# EAGLE design Pi-Matic.-.v0.1 (EAGLE 6.5.0)
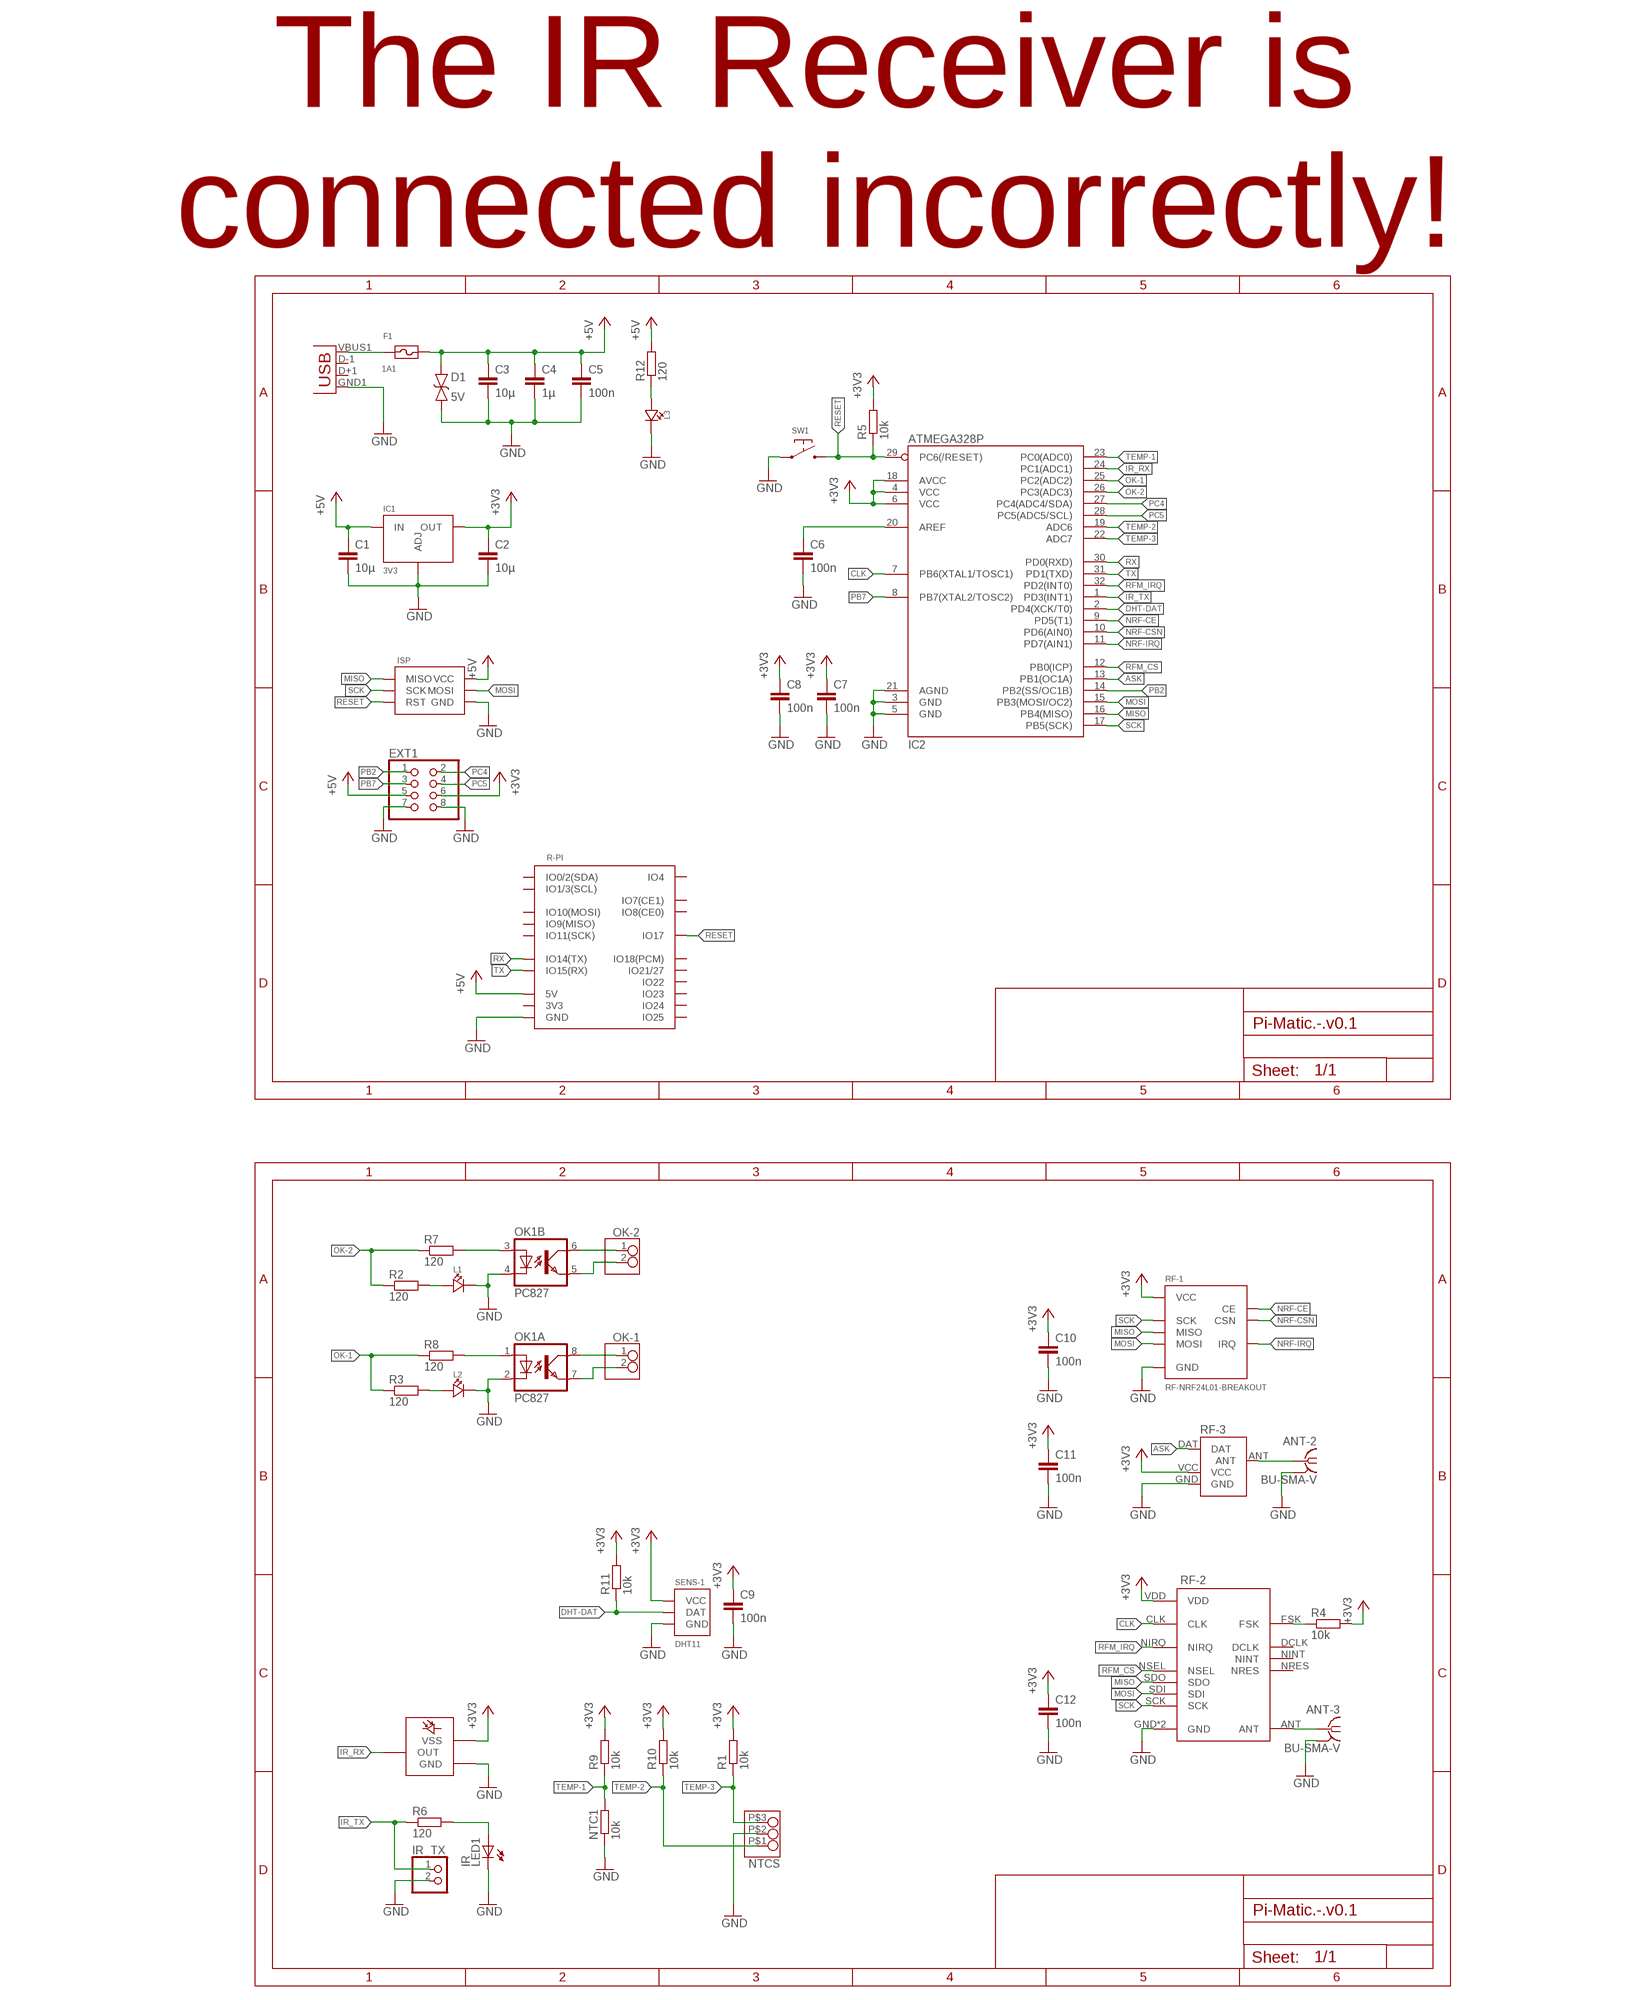
[diagram p0: schematic, sheet 1]

## Parts
ANT-2  BU-SMA-V  [BU-SMA-V]
ANT-3  BU-SMA-V  [BU-SMA-V]
C1  10µ  C-EUC0805  [C0805]
C2  10µ  C-EUC0805  [C0805]
C3  10µ  C-EUC0805  [C0805]
C4  1µ  C-EUC0805  [C0805]
C5  100n  C-EUC0603  [C0603]
C6  100n  C-EUC0603  [C0603]
C7  100n  C-EUC0603  [C0603]
C8  100n  C-EUC0603  [C0603]
C9  100n  C-EUC0603  [C0603]
C10  100n  C-EUC0603  [C0603]
C11  100n  C-EUC0603  [C0603]
C12  100n  C-EUC0603  [C0603]
D1  5V  DIODE-TVS-BI  [R0603]
EXT1  PINHD-2X4  [2X04]
F1  1A1  FUSE1812  [SMD-1812]
IC1  3V3  REGULATOR-TLV1117SOT223  [SOT223]
IC2  ATMEGA328P  ATMEGA328_SMT  [TQFP32-08]
IR_TX  PINHD-1X2/90  [1X02/90]
ISP  ISP-6_PIN-NORMAL  [PINHEADER-100-MIL-2X6-ISP]
L1  LED0603  [CHIPLED_0603]
L2  LED0603  [CHIPLED_0603]
L3  LED0603  [CHIPLED_0603]
LED1  IR  LED5MM  [LED5MM]
NTC1  10k  R-EU_R0805  [R0805]
NTCS  GENERIC-1X3WAGO-5MM  [WAGO-5MM-3_PIN]
OK1  PC827  OPTOCOUPLER-PC827SMD  [SMD08]
OK-1  GENERIC-1X2_PINWAGO-5MM-N  [WAGO-5MM-2_PIN-1]
OK-2  GENERIC-1X2_PINWAGO-5MM-N  [WAGO-5MM-2_PIN-1]
R1  10k  R-EU_R0603  [R0603]
R2  120  R-EU_R0603  [R0603]
R3  120  R-EU_R0603  [R0603]
R4  10k  R-EU_R0603  [R0603]
R5  10k  R-EU_R0603  [R0603]
R6  120  R-EU_R0603  [R0603]
R7  120  R-EU_R0603  [R0603]
R8  120  R-EU_R0603  [R0603]
R9  10k  R-EU_R0603  [R0603]
R10  10k  R-EU_R0603  [R0603]
R11  10k  R-EU_R0603  [R0603]
R12  120  R-EU_R0603  [R0603]
R-PI  RASPBERRY-PI  [RASPBERRY-PI]
RF-1  RF-NRF24L01-BREAKOUT  [RF-NRF2401]
RF-2  RADIO-RFM12SMD  [RADIO-RFM12-SMD]
RF-3  RADIO-QAM_TX1  [RADIO-ASK-QAM-TX1-SIP]
SENS-1  DHT11  DHT11DHT11  [SENSOR-DHT11]
SW1  SWITCH-DEFAULT_OFF-SMD-2_PIN  [SWITCH-SMD-2_PIN-DX]
U$1  IR-RECIEVERTSOP348XX  [IR-REC-3PIN]
U$3  USB  [USB-AB-MICRO-SMD_V03]

## Nets
+3V3: C2.1 C7.1 C8.1 C9.1 C10.1 C11.1 C12.1 EXT1.6 IC1.2(OUT) IC1.4(OUT) IC2.4(VCC) IC2.6(VCC) IC2.18(AVCC) R1.2 R4.2 R5.2 R9.2 R10.2 R11.2 RF-1.P$2(VCC) RF-2.VDD RF-3.VCC SENS-1.P$1(VCC) U$1.P$3(VSS)
+5V: C1.1 C3.1 C4.1 C5.1 D1.1 EXT1.5 F1.P$2 IC1.3(IN) ISP.P$6(VCC) R12.2 R-PI.2(5V) R-PI.4(5V)
ASK: IC2.13(PB1(OC1A)) RF-3.DAT
CLK: IC2.7(PB6(XTAL1/TOSC1)) RF-2.CLK
DHT-DAT: IC2.2(PD4(XCK/T0)) R11.1 SENS-1.P$2(DAT)
GND: ANT-2.2 ANT-2.3 ANT-2.4 ANT-2.5 ANT-3.2 ANT-3.3 ANT-3.4 ANT-3.5 C1.2 C2.2 C3.2 C4.2 C5.2 C6.2 C7.2 C8.2 C9.2 C10.2 C11.2 C12.2 D1.2 EXT1.7 EXT1.8 IC1.1(ADJ) IC2.3(GND) IC2.5(GND) IC2.21(AGND) IR_TX.2 ISP.P$4(GND) L1.C L2.C L3.C LED1.K(C) NTC1.1 NTCS.P$2 OK1.2(A:C) OK1.4(B:C) R-PI.6(GND) R-PI.9(GND) R-PI.14(GND) R-PI.20(GND) R-PI.25(GND) RF-1.P$1(GND) RF-2.GND RF-2.GND_(GND) RF-3.GND SENS-1.P$4(GND) SW1.P$1 U$1.P$2(GND) U$3.GND1(GND)
IR_RX: IC2.24(PC1(ADC1)) U$1.P$1(OUT)
IR_TX: IC2.1(PD3(INT1)) IR_TX.1 R6.1
MISO: IC2.16(PB4(MISO)) ISP.P$1(MISO) RF-1.P$7(MISO) RF-2.SDO
MOSI: IC2.15(PB3(MOSI/OC2)) ISP.P$5(MOSI) RF-1.P$6(MOSI) RF-2.SDI
N$1: ANT-2.1 RF-3.ANT
N$2: ANT-3.1 RF-2.ANT
N$3: LED1.A R6.2
N$4: R4.1 RF-2.FSK
N$5: OK1.1(A:A) R8.2
N$6: OK1.3(B:A) R7.2
N$7: OK1.5(B:EMIT) OK-2.2
N$8: OK1.6(B:COL) OK-2.1
N$9: OK1.8(A:COL) OK-1.1
N$10: OK1.7(A:EMIT) OK-1.2
N$11: L1.A R2.2
N$12: L2.A R3.2
N$13: F1.P$1 U$3.VBUS1(VBUS)
N$14: L3.A R12.1
N$15: C6.1 IC2.20(AREF)
NRF-CE: IC2.9(PD5(T1)) RF-1.P$3(CE)
NRF-CSN: IC2.10(PD6(AIN0)) RF-1.P$4(CSN)
NRF-IRQ: IC2.11(PD7(AIN1)) RF-1.P$8(IRQ)
OK-1: IC2.25(PC2(ADC2)) R3.1 R8.1
OK-2: IC2.26(PC3(ADC3)) R2.1 R7.1
PB2: EXT1.1 IC2.14(PB2(SS/OC1B))
PB7: EXT1.3 IC2.8(PB7(XTAL2/TOSC2))
PC4: EXT1.2 IC2.27(PC4(ADC4/SDA))
PC5: EXT1.4 IC2.28(PC5(ADC5/SCL))
RESET: IC2.29(PC6(/RESET)) ISP.P$3(RST) R5.1 R-PI.11(IO17) SW1.P$2
RFM_CS: IC2.12(PB0(ICP)) RF-2.NSEL
RFM_IRQ: IC2.32(PD2(INT0)) RF-2.NIRQ
RX: IC2.30(PD0(RXD)) R-PI.8(IO14(TX))
SCK: IC2.17(PB5(SCK)) ISP.P$2(SCK) RF-1.P$5(SCK) RF-2.SCK
TEMP-1: IC2.23(PC0(ADC0)) NTC1.2 R9.1
TEMP-2: IC2.19(ADC6) NTCS.P$1 R10.1
TEMP-3: IC2.22(ADC7) NTCS.P$3 R1.1
TX: IC2.31(PD1(TXD)) R-PI.10(IO15(RX))
Unconnected: R-PI.1(3V3) R-PI.3(IO0/2(SDA)) R-PI.5(IO1/3(SCL)) R-PI.7(IO4) R-PI.12(IO18(PCM)) R-PI.13(IO21/27) R-PI.15(IO22) R-PI.16(IO23) R-PI.17(3V3) R-PI.18(IO24) R-PI.19(IO10(MOSI)) R-PI.21(IO9(MISO)) R-PI.22(IO25) R-PI.23(IO11(SCK)) R-PI.24(IO8(CE0)) R-PI.26(IO7(CE1)) RF-2.DCLK RF-2.NINT RF-2.NRES U$3.D+1(D+) U$3.D-1(D-)

## Notes on the sheet
- The IR Receiver is
  connected incorrectly!

## Library data of the parts
ANT-2 ANT-3 = con-coax:BU-SMA-V: FEMALE SMA CONNECTOR Radiall distributor RS 112-3794; OC_FARNELL: unknown; OC_NEWARK: unknown
C1-C12 = p.peter-rcl:C-EU: CAPACITOR, European symbol
D1 = p.peter-passives:DIODE-TVS-BI
EXT1 = pinhead:PINHD-2X4: PIN HEADER
F1 = p.peter-regulators:FUSE
IC1 = p.peter-regulators:REGULATOR-TLV1117
IC2 = SparkFun-DigitalIC:ATMEGA328_SMT: 32-Pin Atmega328 part Commonly used on Arduino compatible boards Available in QFP and QFN packages TQFP is IC-09069 QFN is non-stock; PROD_ID: IC-09069
IR_TX = pinhead:PINHD-1X2: PIN HEADER
ISP = p.peter-connectors:ISP-6_PIN: AVR 6 PIN ISP header Edge connector normal layout
L1-L3 = p.peter-leds:LED
LED1 = led:LED: LED OSRAM: - CHIPLED LG R971, LG N971, LY N971, LG Q971, LY Q971, LO R971, LY R971 LH N974, LH R974 LS Q976, LO Q976, LY Q976 LO Q996 - Hyper CHIPLED LW Q18S LB Q993, LB Q99A, LB R99A - SideLED LS A670, LO A670, LY A670, LG A670, LP A670 LB A673, LV A673, LT A673, LW A673 LH A674 LY A675 LS A676, LA A676, LO A676, LY A676, LW A676 LS A679, LY A679, LG A679 - Hyper Micro SIDELED® LS Y876, LA Y876, LO Y876, LY Y876 LT Y87S - SmartLED LW L88C, LW L88S LB L89C, LB L89S, LG L890 LS L89K, LO L89K, LY L89K LS L896, LA L896, LO L896, LY L896 - TOPLED LS T670, LO T670, LY T670, LG T670, LP T670 LSG T670, LSP T670, LSY T670, LOP T670, LYG T670 LG T671, LOG T671, LSG T671 LB T673, LV T673, LT T673, LW T673 LH T674 LS T676, LA T676, LO T676, LY T676, LB T676, LH T676, LSB T676, LW T676 LB T67C, LV T67C, LT T67C, LS T67K, LO T67K, LY T67K, LW E67C LS E67B, LA E67B, LO E67B, LY E67B, LB E67C, LV E67C, LT E67C LW T67C LS T679, LY T679, LG T679 LS T770, LO T770, LY T770, LG T770, LP T770 LB T773, LV T773, LT T773, LW T773 LH T774 LS E675, LA E675, LY E675, LS T675 LS T776, LA T776, LO T776, LY T776, LB T776 LHGB T686 LT T68C, LB T68C - Hyper Mini TOPLED® LB M676 - Mini TOPLED Santana® LG M470 LS M47K, LO M47K, LY M47K Source: http://www.osram.convergy.de LUXEON: - LUMILED® LXK2-PW12-R00, LXK2-PW12-S00, LXK2-PW14-U00, LXK2-PW14-V00 LXK2-PM12-R00, LXK2-PM12-S00, LXK2-PM14-U00 LXK2-PE12-Q00, LXK2-PE12-R00, LXK2-PE12-S00, LXK2-PE14-T00, LXK2-PE14-U00 LXK2-PB12-K00, LXK2-PB12-L00, LXK2-PB12-M00, LXK2-PB14-N00, LXK2-PB14-P00, LXK2-PB14-Q00 LXK2-PR12-L00, LXK2-PR12-M00, LXK2-PR14-Q00, LXK2-PR14-R00 LXK2-PD12-Q00, LXK2-PD12-R00, LXK2-PD12-S00 LXK2-PH12-R00, LXK2-PH12-S00 LXK2-PL12-P00, LXK2-PL12-Q00, LXK2-PL12-R00 Source: www.luxeon.com KINGBRIGHT: KA-3528ASYC Source: www.kingbright.com
NTC1 R1-R12 = p.peter-rcl:R-EU_: RESISTOR, European symbol
NTCS = p.peter-connectors:GENERIC-1X3
OK1 = p.peter-ics:OPTOCOUPLER-PC827: SHARP OPTO COUPLER
OK-1 OK-2 = p.peter-connectors:GENERIC-1X2_PIN
R-PI = p.peter-periphery:RASPBERRY-PI: Raspberry Pi Board <http://www.raspberrypi.org/> Jacques Lagnel V1.0 (beta) 2012 Board dimension: Forum 3D model <http://www.raspberrypi.org/forum/general-discussion/mechanical-profile-3d-models?value=3d%20model&type=1&include=1&search=1&ret=all> The GPIO Connector (P1): http://elinux.org/RPi_Low-level_peripherals
RF-1 = p.peter-periphery:RF-NRF24L01
RF-2 = p.peter-ics:RADIO-RFM12: RFM12 Funk Modul
RF-3 = p.peter-ics:RADIO-QAM_TX1
SENS-1 = p.peter-periphery:DHT11
SW1 = p.peter-passives:SWITCH-DEFAULT_OFF
U$1 = p.peter-leds:IR-RECIEVER
U$3 = p.peter-connectors:USB

## Board
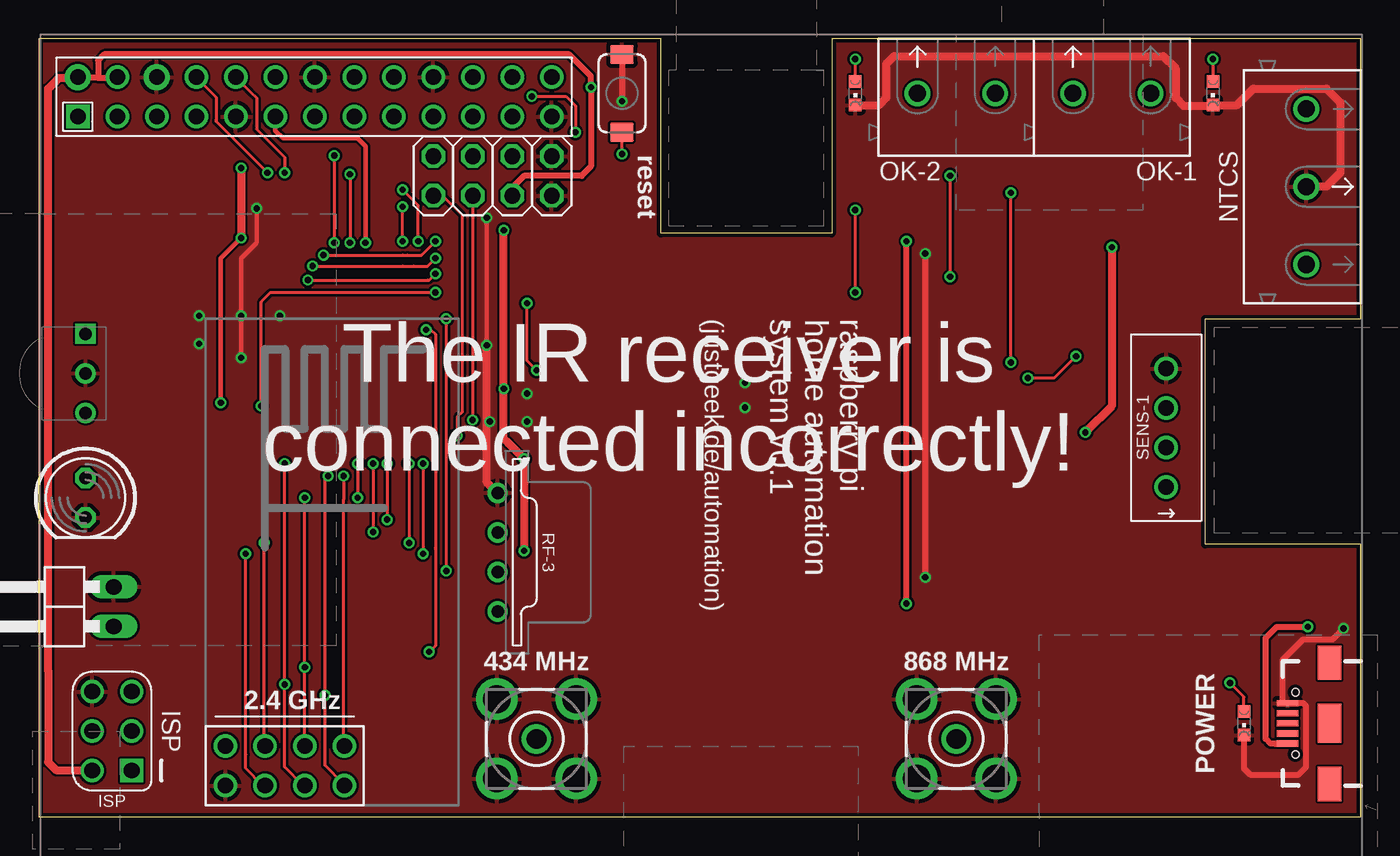
[diagram p1: board, top side]
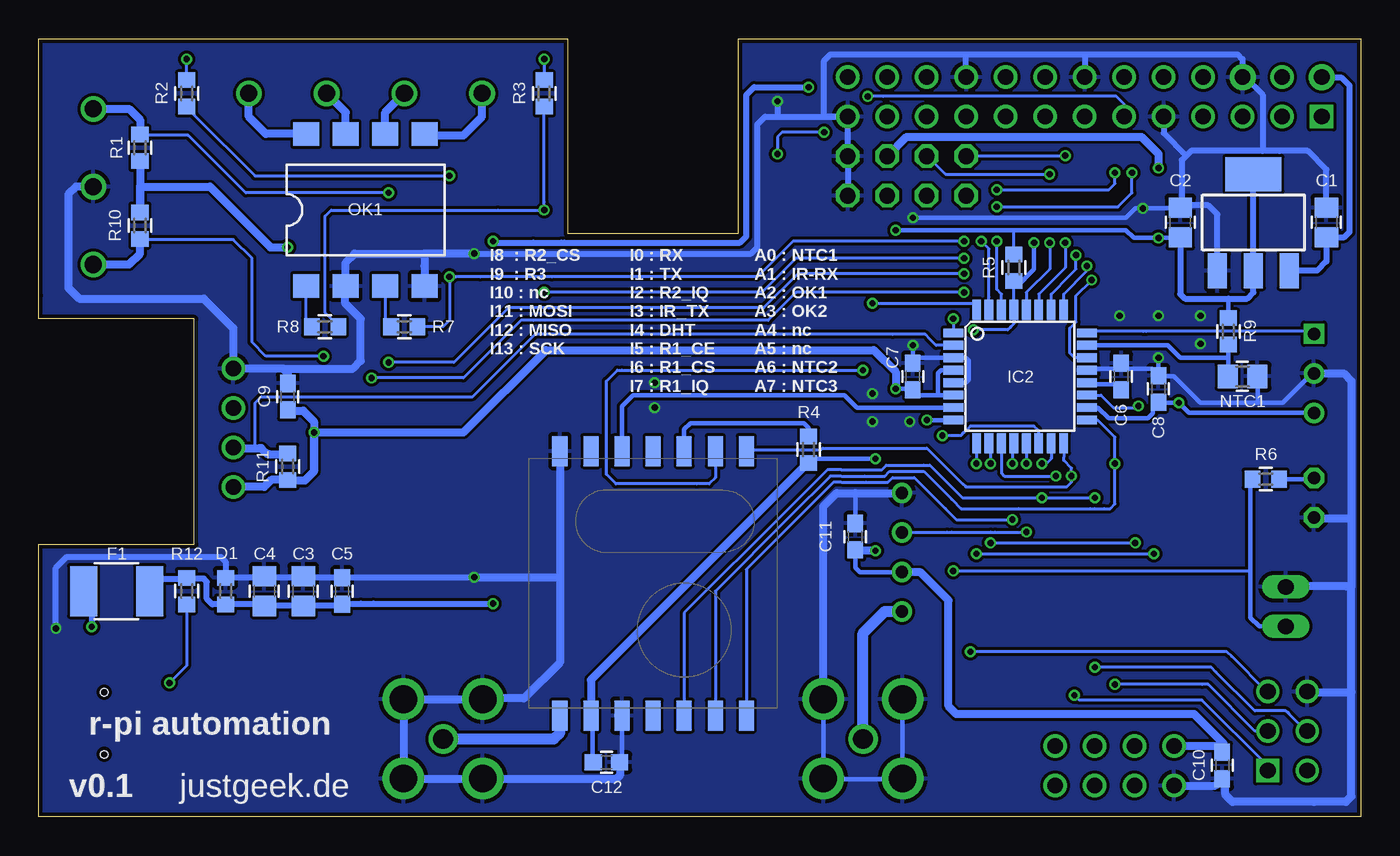
[diagram p2: board, bottom side, seen from below]

Size 85 x 50 mm. Coordinates in mm from the lower left corner, seen from the top.
Outline: 0,0 85,0 85,17.5 75,17.5 75,32 85,32 85,33.5 85,50 51,50 51,37.5 40,37.5 40,50 0,50 0,0
Copper layers (1*16): Top 0.035mm / dielectric 1.5mm / Bottom 0.035mm
Design rules "Elecrow_2-layer_eagle_rule *": minimum track width 6mil, minimum drill 12mil, track to track 6mil, track to pad 6mil, pad to pad 6mil, via to via 6mil, smd to smd 0mil, copper to edge 10mil, drill to drill 10mil, minimum pad ring 10mil, minimum via ring 6mil, stop-mask expansion 2mil, vias tented up to drill 100mil, thermal gap 10mil

### Footprints (pad centres in the part's own frame; a part is rotated, then mirrored left to right if it is on the bottom)
BU-SMA-V = drill 1.27: 1 0,0 | drill 1.778: 2 -2.55,2.55; 3 2.55,2.55; 4 2.55,-2.55; 5 -2.55,-2.55
C0805 = smd 1.3 x 1.5: 1 -0.95,0; 2 0.95,0
C0603 = smd 1.1 x 1: 1 -0.85,0; 2 0.85,0
R0603 = smd 1 x 1.1: 1 -0.85,0; 2 0.85,0
2X04 = drill 1.016 octagon: 1 -3.81,-1.27; 2 -3.81,1.27; 3 -1.27,-1.27; 4 -1.27,1.27; 5 1.27,-1.27; 6 1.27,1.27; 7 3.81,-1.27; 8 3.81,1.27
SMD-1812 = smd 1.75 x 3.2: P$1 -2.125,0; P$2 2.125,0
SOT223 = smd 1.219 x 2.235: 1 -2.311,-3.099; 2 0,-3.099; 3 2.311,-3.099 | smd 3.6 x 2.2: 4 0,3.099
TQFP32-08 = smd 1.27 x 0.559: 1 -4.293,2.8; 2 -4.293,2; 3 -4.293,1.2; 4 -4.293,0.4; 5 -4.293,-0.4; 6 -4.293,-1.2; 7 -4.293,-2; 8 -4.293,-2.8; 17 4.293,-2.8; 18 4.293,-2; 19 4.293,-1.2; 20 4.293,-0.4; 21 4.293,0.4; 22 4.293,1.2; 23 4.293,2; 24 4.293,2.8 | smd 0.559 x 1.27: 9 -2.8,-4.293; 10 -2,-4.293; 11 -1.2,-4.293; 12 -0.4,-4.293; 13 0.4,-4.293; 14 1.2,-4.293; 15 2,-4.293; 16 2.8,-4.293; 25 2.8,4.293; 26 2,4.293; 27 1.2,4.293; 28 0.4,4.293; 29 -0.4,4.293; 30 -1.2,4.293; 31 -2,4.293; 32 -2.8,4.293
1X02/90 = drill 1.016 long: 1 -1.27,-3.81; 2 1.27,-3.81
PINHEADER-100-MIL-2X6-ISP = drill 1 square: P$1 -2.54,-1.27 | drill 1: P$2 0,-1.27; P$3 2.54,-1.27; P$4 2.54,1.27; P$5 0,1.27; P$6 -2.54,1.27
CHIPLED_0603 = smd 0.8 x 0.8: A 0,-0.75; C 0,0.75
LED5MM = drill 0.813 octagon: A -1.27,0; K 1.27,0
R0805 = smd 1.3 x 1.5: 1 -0.95,0; 2 0.95,0
WAGO-5MM-3_PIN = drill 1.1: P$1 -5,0; P$2 0,0; P$3 5,0
SMD08 = smd 1.651 x 1.524: 1 -3.81,-4.889; 2 -1.27,-4.889; 3 1.27,-4.889; 4 3.81,-4.889; 5 3.81,4.889; 6 1.27,4.889; 7 -1.27,4.889; 8 -3.81,4.889
WAGO-5MM-2_PIN-1 = drill 1.1: 1 -2.5,0; 2 2.5,0
RASPBERRY-PI = drill 1 square: 1 0,0 | drill 1 pad 1.676: 2 0,2.54; 6 5.08,2.54 | drill 1: 3 2.54,0; 4 2.54,2.54; 5 5.08,0; 7 7.62,0; 8 7.62,2.54; 9 10.16,0; 10 10.16,2.54; 11 12.7,0; 12 12.7,2.54; 13 15.24,0; 14 15.24,2.54; 15 17.78,0; 16 17.78,2.54; 17 20.32,0; 18 20.32,2.54; 19 22.86,0; 20 22.86,2.54; 21 25.4,0; 22 25.4,2.54; 23 27.94,0; 24 27.94,2.54; 25 30.48,0; 26 30.48,2.54
RF-NRF2401 = drill 1: P$1 0,0; P$2 0,2.55; P$3 2.55,0; P$4 2.55,2.55; P$5 5.1,0; P$6 5.1,2.55; P$7 7.65,0; P$8 7.65,2.55
RADIO-RFM12-SMD = smd 1.93 x 0.965: ANT 8.5,-6; CLK -8.5,-2; DCLK -8.5,0; FSK -8.5,2; GND -8.5,-6; GND_ 8.5,-2; NINT 8.5,0; NIRQ -8.5,4; NRES -8.5,-4; NSEL 8.5,6; SCK 8.5,4; SDI 8.5,2; SDO -8.5,6; VDD 8.5,-4
RADIO-ASK-QAM-TX1-SIP = drill 0.8: ANT 3.81,0; DAT -1.27,0; GND -3.81,0; VCC 1.27,0
SENSOR-DHT11 = drill 1: P$1 -3.81,0; P$2 -1.27,0; P$3 1.27,0; P$4 3.81,0
SWITCH-SMD-2_PIN-DX = smd 1.2 x 1.5: P$1 -2.5,0; P$2 2.5,0
IR-REC-3PIN = drill 0.8 square: P$1 -2.54,0 | drill 0.8: P$2 0,0; P$3 2.54,0
USB-AB-MICRO-SMD_V03 = smd 1.4 x 0.4: D+1 2.7,0; D-1 2.7,0.65; GND1 2.7,-1.3; ID1 2.7,-0.65; VBUS1 2.7,1.3 | smd 1.5 x 2.2: P$1 0,3.9; P$2 0,-3.9 | smd 1.5 x 2.5: P$3 0,0 | hole 0.45: 2.2,2; 2.2,-2

### Placement (x,y rotation side)
ANT-2  32,5 0 top
ANT-3  59,5 0 top
C1  2.2,38.2 90 bottom
C2  11.6,38.2 90 bottom
C3  68,14.5 90 bottom
C4  70.5,14.5 90 bottom
C5  65.5,14.5 90 bottom
C6  15.4,28.3 90 bottom
C7  28.8,28.3 90 bottom
C8  13,27.5 90 bottom
C9  69,27 90 bottom
C10  8.9,3.3 270 bottom
C11  32.5,18 90 bottom
C12  48.5,3.5 0 bottom
D1  73,14.5 90 bottom
EXT1  29.18,41.2 0 top
F1  80,14.5 0 bottom
IC1  6.9,38.2 0 bottom
IC2  21.9,28.3 0 bottom
IR_TX  1,13.5 90 top
ISP  4.7,5.5 90 top
L1  75.5,46.5 180 top
L2  52.5,46.5 180 top
L3  77.5,6 180 top
LED1  3,20.5 270 top
NTC1  7.6,28.3 180 bottom
NTCS  81.5,40.5 90 top
OK1  64,39 0 bottom
OK-1  69,46.5 180 top
OK-2  59,46.5 180 top
R1  78.5,43 270 bottom
R2  75.5,46.5 90 bottom
R3  52.5,46.5 90 bottom
R4  35.5,23.6 270 bottom
R5  22.3,35.3 90 bottom
R6  6.1,21.7 0 bottom
R7  61.5,31.5 180 bottom
R8  66.6,31.5 180 bottom
R9  8.5,31.2 90 bottom
R10  78.5,38 90 bottom
R11  69,22.5 270 bottom
R12  75.5,14.5 90 bottom
R-PI  2.5,45 0 top
RF-1  12,2 0 top
RF-2  45.5,15 270 bottom
RF-3  29.5,17 270 top
SENS-1  72.5,25 90 top
SW1  37.5,46.5 270 top
U$1  3,28.5 270 top
U$2  [LOGO-JUSTGEEK-XS-MASK]  50,9.5 270 top
U$3  83,6 180 top

### Tracks (layer width: path | path; a pad name or v marks a point on that pad's centre or on a via)
+3V3  (via drill 0.4)
  Top 0.3: v11.7,26.6 11.7,35.9 v13,37.2
  Top 0.5: v29.9,37.7 v29.9,27.5 29.9,24.3 30.2,24 v31.2,23 v31.2,17.1 | v13,41.7 13,37.3 v13,37.2 | v69,36.6 69,26.4 v67.3,24.7
  Bottom 0.2: R5.2 22.3,36.1 22.3,37.7
  Bottom 0.3: C11.1 32.5,16 32.2,15.7 29.53,15.7 RF-3.VCC | C12.1 49.4,3.5 49.4,6.4 RF-2.VDD | IC2.4 27,28.7 27.2,28.5 27.2,27.3 27.2,27.1 | 27.2,27.1 IC2.6 | C7.1 28.8,27.1 | 28.8,27.1 27.2,27.1 | IC2.18 17.61,26.21 17.6,26.2 17.5,26.3 16.9,26.3 16.2,25.6 13.7,25.6 13.35,25.95 13.35,26.3 C8.1 13,26.6 | 13,26.6 13,26.3 13,26.6 | 13,26.6 v11.7,26.6 11.06,25.96 U$1.P$3 | C2.1 11.65,37.2 v13,37.2 14.6,37.2 15.1,37.7 22.3,37.7 v29.9,37.7 | R9.2 8.5,32 8.5,33.3 | 28.8,27.1 29,27.1 29,27.3 28.8,27.5 v29.9,27.5 | 35.35,22.9 35.2,22.9 | 35.5,22.8 35.6,22.8 35.4,23 v31.2,23
  Bottom 0.4: IC1.4 6.9,41.5 7,41.6 7,41.4 IC1.4 | IC1.4 IC1.2 6.9,33.7 7.3,33.3 8.5,33.3 11.3,33.3 11.6,33.6 C2.1 | 35.35,22.9 35.35,22.75 R4.2 35.5,22.8
  Bottom 0.5: R4.2 35.55,22.7 35.6,22.7 37,21.3 49.5,8.8 RF-2.VDD | RF-1.P$2 9.3,4.55 C10.1 8.8,4.25 8.8,4.7 10.7,6.6 12.4,6.6 24.9,6.6 26,6.6 26.5,7.1 26.5,13.9 28.3,15.7 29.47,15.7 | EXT1.6 30.43,42.47 30.4,42.5 29.2,43.7 14.1,43.7 13,42.6 v13,41.7 | SENS-1.P$1 70.5,21.2 70.05,21.65 R11.2 68.95,21.6 67.9,21.6 67.3,22.2 | C9.1 69,26.1 68,26.1 67.3,25.4 v67.3,24.7 | v67.3,24.7 67.3,22.2 | R1.2 78.5,40.5 | 78.5,40.5 R10.2 78.5,40.5 | v31.2,17.1 32.45,17.1 C11.1 | 29.47,15.7 RF-3.VCC 29.47,15.7 | 67.3,22.2 v67.3,24.7 | v67.3,24.7 57.7,24.7 52.4,30 31.3,30 29.9,28.6 v29.9,27.5 | 78.5,40.5 74,40.5 70.1,36.6 v69,36.6
+5V  (via drill 0.4)
  Top 0.4: v55.8,13.7 v55.8,37 | 3.8,47.5 3.8,48.6 4.2,49 34.1,49 35.5,47.6 v35.5,46.9 35.5,41.8 34.9,41.2 31.2,41.2 30.5,40.5 30.5,39.98 EXT1.5 | 3.8,47.5 5,47.5 R-PI.4 | 3.8,47.5 2.54,47.5 R-PI.2
  Top 0.5: R-PI.2 2.46,47.5 1.3,47.5 0.6,46.8 0.6,9.4 0.6,3.5 1.1,3 3.43,3 ISP.P$6
  Bottom 0.4: F1.P$2 77.88,15.02 77.6,15.3 75.55,15.3 R12.2 75.45,15.3 74.4,15.3 74.2,15.1 74.2,14 73.85,13.65 D1.1 73,13.7 70.65,13.7 C4.1 70.55,13.55 70.6,13.6 68.05,13.6 C3.1 68,13.6 65.55,13.6 C5.1 65.5,13.7 64.3,13.7 63.5,13.7 v55.8,13.7 | v55.8,37 55.7,36.9 53.2,36.9 51.4,36.9 51.2,36.9 39.9,36.9 39.5,37.3 39.5,46.4 39,46.9 v35.5,46.9 | IC1.3 2.8,35.1 2.2,35.7 C1.1 1.05,37.25 0.7,37.6 0.7,47 1.2,47.5 2.46,47.5 R-PI.2
ASK  (via drill 0.4)
  Top 0.2: v21.5,22.7 v21.5,18.3
  Bottom 0.2: RF-3.DAT 29.5,18.3 26.6,18.3 26.3,18.3 23.8,18.3 23.5,18.3 v21.5,18.3 | IC2.13 v21.5,22.7
CLK
  Bottom 0.3: RF-2.CLK 47.5,26.4 46.8,27.1 33.2,27.1 32.4,26.3 IC2.7
DHT-DAT
  Bottom 0.2: R11.1 70.15,23.35 70.2,23.3 70.4,23.3 70.8,23.7 71.1,23.7 71.1,26.6 70.7,27 57.1,27 53.1,31 30.1,31 28,31 27.7,30.7 27.3,30.3 IC2.2
  Bottom 0.5: SENS-1.P$2 72.5,23.7 71.1,23.7 70.8,23.7 70.7,23.7 70.3,23.3 70.2,23.3 69.05,23.3 R11.1
GND  (via drill 0.4)
  Top 0.3: v13,29.5 13,35.9 14,36.9 v14,39.1 | v28.8,30.3 v28.8,38.5
  Top 0.4: L3.C 77.5,3.1 77.9,2.7 81,2.7 81.5,3.2 81.5,7.1 81.3,7.3 U$3.GND1 80,7.3 80,10.1 80.4,10.5 81.2,11.3 81.3,11.4 83.2,11.4 v83.9,12.1 | v57,15.4 v57,36.2 | SW1.P$1 37.5,49.1 v37.5,46
  Top 0.5: L2.C 54.05,45.75 54.5,46.2 54.5,48.4 55,48.9 72.3,48.9 73.1,48.1 73.1,46.2 73.6,45.7 74.95,45.7 75.5,45.7 | L1.C 77.05,45.75 77.6,46.3 78.1,46.8 82.8,46.8 83.7,45.9 83.7,41.4 82.8,40.5 81.6,40.5 NTCS.P$2 | RF-3.GND 28.8,21.51 v28.8,30.3 | 75.5,45.7 75.5,45.8 75.5,45.7
  Bottom 0.3: RF-3.GND 32.5,20.8 32.5,20.5 C11.2 | ANT-2.5 | ANT-2.5 29.5,2.4 34.5,2.4 ANT-2.4 ANT-2.3 | ANT-2.2 ANT-2.5 | RF-2.GND_ 47.5,3.65 C12.2 | IC2.5 25.4,27.9 25.2,28.1 25.2,29.3 25.4,29.5 IC2.3 28.8,29.5 | IC2.21 17.61,28.79 17.6,28.8 15.75,28.8 15.62,28.92 | 15.62,28.92 C6.2 | C8.2 13,28.6 | 13,28.6 13.1,28.7 | 13.1,28.7 13.3,28.7 13.4,28.8 15.5,28.8 15.62,28.92 | 13.1,28.7 13,28.6 | 13,28.6 v13,29.5 | C2.2 11.65,39.1 v14,39.1 14.5,39.1 15.1,38.5 v28.8,38.5 | 12.95,28.3 C8.2 | 4.78,14.8 IR_TX.2 | LED1.K 3,19.2 | U$1.P$2 3.1,28.5 5,26.6 6.6,26.6 | 6.6,26.6 10.3,26.6 12,28.3 12.95,28.3 | 12.95,28.3 C8.2 | NTC1.1 6.65,28.35 6.6,28.4 6.6,26.6 | 28.8,29.5 C7.2 28.8,29.5 | 28.8,29.5 v28.8,30.3
  Bottom 0.4: v83.9,12.1 83.9,16 83.2,16.7 73.3,16.7 73,16.4 D1.2 73,15.4 70.55,15.4 C4.2 70.5,15.4 68.05,15.4 C3.2 67.95,15.45 67.9,15.4 65.55,15.4 C5.2 65.5,15.4 v57,15.4 | v57,36.2 39.2,36.2 38.8,36.6 38.8,44.5 38.3,45 37.5,45 | 34.5,45 34.6,45 37.5,45 | 34.5,45 33,45 | 33,45 R-PI.25 | R-PI.25 33,45 | 33,45 33,42.48 EXT1.8 EXT1.7 | R-PI.25 34.5,45 | 34.5,45 34.5,48.6 34.1,49 25.4,49 | 25.4,49 17.7,49 | 17.7,49 7.9,49 7.6,48.7 7.6,47.56 R-PI.6 7.44,47.54 6.3,46.4 6.3,42.8 | R-PI.14 17.7,47.5 17.7,49 | R-PI.20 25.36,47.56 25.4,47.6 25.4,49 | v37.5,46 37.5,45 | C1.2 2.2,41.6 3.4,42.8 5.2,42.8 6.3,42.8 | 6.3,42.8 10.9,42.8 11.2,42.5 | 11.2,42.5 11.5,42.2 11.5,39.45 | IC1.1 9.21,38.71 9.8,39.3 11.5,39.3 | 11.5,39.3 11.55,39.3 | R-PI.9 12.66,43.96 11.2,42.5 | 11.5,39.45 11.5,39.3 | 11.5,39.3 11.5,39.15 C2.2 | 11.5,39.45 11.5,39.3
  Bottom 0.5: ANT-2.3 34.55,19.95 33.7,20.8 32.5,20.8 RF-3.GND | C12.2 47.6,3.45 47.6,2.7 47.85,2.45 ANT-3.5 ANT-3.4 ANT-3.3 ANT-3.2 56.4,7.6 53.8,7.6 51.5,9.9 51.5,15.4 | RF-2.GND 51.5,15.4 | v57,15.4 51.5,15.4 | U$1.P$2 1.1,28.5 0.6,28 0.6,19.2 | 0.6,19.2 0.6,14.8 | 0.6,14.8 0.9,14.8 4.78,14.8 | 3,19.2 0.6,19.2 | RF-1.P$1 9.35,2 C10.2 8.7,2.25 8.7,1.4 8.25,0.95 3,0.95 0.95,0.95 0.6,1.3 0.6,8 | 0.6,8 0.6,14.8 | C9.2 69,28 69,28.5 69.3,28.8 | 69.3,28.8 SENS-1.P$4 72.5,31.4 74.4,33.3 82.4,33.3 83.1,34 83.1,40 82.6,40.5 NTCS.P$2 | 60.2,36.2 64.7,36.2 65.27,35.63 OK1.2 65.3,34.08 65.3,33 64.3,32 64.3,29.3 64.8,28.8 69.3,28.8 | 60.2,36.2 60.2,35.4 OK1.4 | v57,36.2 60.2,36.2 | ISP.P$4 3.5,8.04 3.5,8 0.6,8
  other vias: 10.3,30.4 10.3,32.2 13,32.2 15.5,32.2 31.4,27.2 31.4,25.4 29,25.4 45.4,27.9 45.4,26.3
  pour Bottom (isolate 0.19): 0,0 0,50 85,50 85,0
  pour Top: 0,0 0,50 85,50 85,0
IR_RX
  Bottom 0.2: U$1.P$1 3,31.1 3.1,31.2 13.8,31.2 14,31.2 17.51,31.2 IC2.24
IR_TX  (via drill 0.4)
  Top 0.2: v26.2,32 v26.2,15.8
  Bottom 0.2: 7.1,21.55 7.05,21.55 6.9,21.7 | v26.2,15.8 7.1,15.8 7.1,15.6 | v26.2,32 IC2.1
  Bottom 0.3: IR_TX.1 6.53,12.23 7.1,12.8 7.1,15.6 7.1,15.8 7.1,21.55 R6.1
MISO  (via drill 0.4)
  Top 0.2: 19.7,2 19.6,2.1 18.4,3.3 v18.4,7.8 18.4,21.7 v18.6,21.9
  Top 0.3: RF-1.P$7 19.7,2
  Bottom 0.2: RF-2.SDO 39.2,23.5 39.2,23.6 34.7,23.6 34.6,23.7 27.9,23.7 25.6,21.4 25.4,21.2 18.9,21.2 18.6,21.5 18.6,22.4 | IC2.16 19.1,23.1 19.1,22.9 18.6,22.4 | v18.6,21.9 18.6,22.4 | v18.4,7.8 18.1,7.5 10.2,7.5 6,3.3 6,3 6,2.96 ISP.P$1
MOSI  (via drill 0.4)
  Top 0.2: 17.1,4.6 v17.1,9.6 17.1,20.4 v17.1,20.5 | v20.5,22.7 v20.5,20.5
  Top 0.3: RF-1.P$6 17.1,4.6
  Bottom 0.2: RF-2.SDI 43.5,13.1 37,19.6 34.3,22.3 33.4,22.3 31.2,22.3 30.8,22.3 30.5,22.6 28.1,22.6 27.7,22.6 25.6,20.5 25.4,20.5 v20.5,20.5 v17.1,20.5 | IC2.15 19.9,23.1 19.9,23 20.2,22.7 v20.5,22.7 | v17.1,9.6 9.6,9.6 9.3,9.3 6.8,6.8 4.8,6.8 4.7,6.7 4.6,6.6 3.5,5.5 ISP.P$5
N$1
  Bottom 0.5: RF-3.ANT
  Bottom 0.7: ANT-2.1 32,11.8 30.6,13.2 RF-3.ANT
N$2
  Bottom 0.7: ANT-3.1 51.9,5 51.5,5.4 RF-2.ANT
N$3
  Bottom 0.3: R6.2 5.1,21.7 3.07,21.7 LED1.A
N$4
  Bottom 0.3: RF-2.FSK 43.5,24.2 43.5,24.9 43.1,25.3 35.8,25.3 35.5,25 R4.1
N$5
  Bottom 0.2: R8.2 67.8,31.5 OK1.1
N$6
  Bottom 0.2: R7.2 62.7,31.5 62.7,34.08 OK1.3
N$7
  Bottom 0.5: OK1.5 60.19,43.81 60.2,43.8 57.7,43.8 56.5,45 OK-2.2
N$8
  Bottom 0.5: OK1.6 62.73,45.27 OK-2.1
N$9
  Bottom 0.5: OK1.8 70.4,43.9 71.5,45 OK-1.1
N$10
  Bottom 0.5: OK1.7 65.27,45.27 OK-1.2
N$11  (via drill 0.4)
  Top 0.2: v75.5,48.7 L1.A
  Bottom 0.2: R2.2 v75.5,48.7
N$12  (via drill 0.4)
  Top 0.2: L2.A v52.5,48.7
  Bottom 0.2: v52.5,48.7 R3.2
N$13  (via drill 0.4)
  Top 0.4: 79.5,4.7 79.2,4.7 78.9,5 78.9,11.5 79.6,12.2 v81.6,12.2
  Top 0.406: U$3.VBUS1 79.5,4.7
  Bottom 0.4: F1.P$1 82.3,14.5 81.6,14.5 v81.6,12.2
N$14  (via drill 0.4)
  Top 0.2: L3.A 77.5,7.7 v76.6,8.6
  Bottom 0.2: R12.1 75.5,9.7 v76.6,8.6
N$15
  Bottom 0.3: IC2.20 17.3,27.9 17.2,27.8 15.75,27.8 C6.1
NRF-CE  (via drill 0.4)
  Top 0.2: 14.4,2 13.3,3.1 13.3,4 v13.3,16.9 | v24.7,22.7 v24.7,16.9
  Top 0.3: RF-1.P$3 14.4,2
  Bottom 0.2: IC2.9 | IC2.9 24.7,23.6 IC2.9 | IC2.9 v24.7,22.7 | v24.7,16.9 v13.3,16.9
NRF-CSN  (via drill 0.4)
  Top 0.2: 14.5,4.6 v14.5,17.6 | v23.8,22.7 v23.8,17.6
  Top 0.3: RF-1.P$4 14.5,4.6
  Bottom 0.2: IC2.10 23.9,23.7 23.8,23.7 23.8,23.5 v23.8,22.7 | v23.8,17.6 v14.5,17.6
NRF-IRQ  (via drill 0.4)
  Top 0.2: 19.6,4.5 19.6,5.1 19.6,20.4 v19.6,21.9
  Top 0.3: RF-1.P$8 19.6,4.5
  Bottom 0.2: IC2.11 23.1,22.9 23.1,22.1 22.9,21.9 v19.6,21.9
OK-1  (via drill 0.4)
  Top 0.2: v17.6,35.4 23.4,35.4 24.1,35.4 25,35.4 v25.5,35.9 | v52.5,33.7 v52.5,39
  Bottom 0.2: R8.1 65.75,31.55 66.6,32.4 66.6,38.6 66.2,39 55.5,39 v52.5,39 52.5,39.5 R3.1 | IC2.25 19.1,33.6 17.6,35.1 v17.6,35.4 | v25.5,35.9 36.3,35.9 38.5,33.7 52.3,33.7 v52.5,33.7
OK-2  (via drill 0.4)
  Top 0.2: v18.3,36.1 23.4,36.1 23.7,36.1 24.6,36.1 v25.5,37 | v58.6,41.2 58.6,35 v58.6,34.7
  Bottom 0.2: IC2.26 19.9,33.6 18.7,34.8 18.3,35.2 v18.3,36.1 | v25.5,37 36.5,37 38.8,34.7 52,34.7 56.6,34.7 58.2,34.7 v58.6,34.7 58.6,31.9 59,31.5 59.8,31.5 R7.1 | v58.6,41.2 71.1,41.2 75,45.1 75.2,45.3 75.2,45.65 R2.1
PB2  (via drill 0.4)
  Top 0.2: EXT1.1 | 25.4,39.9 26,39.9 27.2,38.7 27.2,26 26.9,25.7 v26.9,24.5
  Top 0.3: EXT1.1 25.4,39.9
  Bottom 0.2: IC2.14 20.7,24.8 21,25.1 25.1,25.1 25.5,24.7 25.7,24.5 v26.9,24.5
PB7  (via drill 0.4)
  Top 0.2: 27.9,39.9 v27.9,25.5
  Top 0.3: EXT1.3 27.91,39.91 27.9,39.9
  Bottom 0.3: v27.9,25.5 IC2.8
PC4  (via drill 0.4)
  Top 0.2: v19,42.5 19,37.1 v19,36.9
  Bottom 0.2: EXT1.2 25.34,42.47 | 25.3,42.5 v19,42.5 | v19,36.9 19,35.3 20.7,33.6 IC2.27
  Bottom 0.3: 25.34,42.47 25.3,42.5
PC5  (via drill 0.4)
  Top 0.2: v20,41.3 20,37.2 v20,36.9
  Bottom 0.2: EXT1.4 27.91,42.41 | 27.8,42.4 26.7,41.3 v20,41.3 | v20,36.9 20,35.2 21.5,33.7 IC2.28
  Bottom 0.3: 27.91,42.41 27.9,42.4 27.8,42.4
RESET  (via drill 0.4)
  Top 0.2: v31.7,46.3 33.9,46.3 34.5,45.7 v34.5,44 | v37.5,42.6 SW1.P$2 | v24.9,31.3 25.2,31.3 25.5,31 25.5,17.3 25.5,17.2 25.5,11 v25.1,10.6
  Top 0.3: R-PI.11 15.2,44.9 15.2,44.1 15.7,43.6 20.5,43.6 21,43.1 21,42.5 21,37 v21,36.9
  Bottom 0.2: 22.3,34.5 R5.1 22.3,34.35 22.3,32.7 IC2.29 22.3,31.7 22.5,31.5 22.7,31.3 v24.9,31.3 | R-PI.11 15.2,45.8 15.7,46.3 30.7,46.3 v31.7,46.3 | v34.5,44 37.2,44 37.5,43.7 v37.5,42.6 | v25.1,10.6 8.6,10.6 8.3,10.3 6,8 ISP.P$3
  Bottom 0.3: v21,36.9 21,35.2 21.4,34.8 21.8,34.4 22.25,34.4 R5.1
RFM_CS  (via drill 0.4)
  Top 0.2: v22.4,22.7 v22.4,19.1
  Bottom 0.2: RF-2.NSEL 39.5,15.9 36.5,18.9 33.9,21.5 33.4,21.5 31.8,21.5 30.4,21.5 30.1,21.8 28.7,21.8 26.7,19.8 26,19.1 v22.4,19.1 | IC2.12 22.3,23.8 22.4,23.7 v22.4,22.7
RFM_IRQ  (via drill 0.4)
  Top 0.2: v32,28.7 31.4,29.3 v31.4,33
  Bottom 0.2: 41.5,23.6 41.5,21.8 41.9,21.4 42.7,21.4 47.9,21.4 48.5,22 48.5,28 47.8,28.7 47.5,28.7 v32,28.7 | v31.4,33 31.1,33 24.9,33 24.71,32.81 IC2.32
  Bottom 0.3: RF-2.NIRQ 41.5,23.6
RX  (via drill 0.4)
  Top 0.2: R-PI.8 11.4,46.26 11.4,44.8 11.4,44.7 14.4,41.7 v14.7,41.4 | v23.4,37 v23.4,39.2
  Bottom 0.2: IC2.30 23.1,33.6 23.4,33.9 v23.4,37 | v23.4,39.2 15.6,39.2 14.7,40.1 v14.7,41.4
SCK  (via drill 0.4)
  Top 0.2: 17,2 15.8,3.2 v15.8,8.5 v15.8,22.7
  Top 0.3: RF-1.P$5 17,2
  Bottom 0.2: RF-2.SCK 41.5,14.5 36.7,19.3 34.1,21.9 33.4,21.9 31.9,21.9 30.6,21.9 30.3,22.2 28.1,22.2 26.3,20.4 25.7,19.8 22,19.8 17.4,19.8 17.1,19.8 16.5,19.8 16.1,19.8 15.8,20.1 v15.8,22.7 15.8,24.4 16.9,25.5 IC2.17 | v15.8,8.5 10.2,8.5 9.8,8.5 6.8,5.5 6,5.5 ISP.P$2
TEMP-1
  Bottom 0.3: 8.5,28.6 8.5,28.4 8.55,28.35 NTC1.2 8.55,28.55 8.5,28.6 | 8.5,28.6 8.5,29.5 | 8.5,29.5 R9.1 | 8.5,28.6 8.5,29.5 | 8.5,29.5 11.6,29.5 12.4,30.3 IC2.23
TEMP-2  (via drill 0.4)
  Top 0.2: v14.3,26.4 14.3,33.1 14.9,33.7 25.1,33.7 v25.5,33.7 | v63.6,28.2 65.3,28.2 v66.7,29.6
  Bottom 0.2: IC2.19 16.7,27.1 15.9,26.3 14.4,26.3 v14.3,26.4 | v25.5,33.7 36.3,33.7 38.1,31.9 53.2,31.9 54,31.9 57.7,28.2 v63.6,28.2 | v66.7,29.6 70.4,29.6 71.3,30.5 71.3,35.9 72.5,37.1 78.45,37.1 R10.1
  Bottom 0.5: NTCS.P$1 79.2,35.5 78.5,36.2 R10.1
TEMP-3  (via drill 0.4)
  Top 0.2: v17.3,34.5 25,34.5 25.1,34.5 v25.5,34.9 | v62.5,29.2 v62.5,40.1
  Bottom 0.2: IC2.22 18.4,29.5 18.6,29.7 18.7,29.8 18.7,31.4 18.4,31.7 18.3,31.8 18.3,33.5 v17.3,34.5 | v25.5,34.9 36.2,34.9 38.4,32.7 52.2,32.7 54.8,32.7 58.3,29.2 v62.5,29.2 | v62.5,40.1 71.7,40.1 75.4,43.8 78.45,43.8 R1.1
  Bottom 0.5: NTCS.P$3 79.2,45.5 78.5,44.8 R1.1
TX  (via drill 0.4)
  Top 0.2: R-PI.10 12.7,47.5 13.6,46.6 14,46.2 14,44.4 14,44.2 15.8,42.4 v15.8,41.4 | v24.4,37 24.4,39.3 v23.4,40.3
  Bottom 0.2: IC2.31 23.9,33.4 23.9,36.5 24.2,36.8 24.3,36.9 v24.4,37 | v23.4,40.3 16.2,40.3 15.8,40.7 v15.8,41.4

### Text on the board
tPlace: reset | (justgeek.de/automation) | raspberry pi / home automation / system v0.1 | The IR receiver is / connected incorrectly! | 434 MHz | 868 MHz | 2.4 GHz | POWER | ISP
bPlace: A0 : NTC1 / A1 : IR-RX / A2 : OK1 / A3 : OK2 / A4 : nc / A5 : nc / A6 : NTC2 / A7 : NTC3 | I0 : RX / I1 : TX / I2 : R2_IQ / I3 : IR_TX / I4 : DHT / I5 : R1_CE / I6 : R1_CS / I7 : R1_IQ | I8 : R2_CS / I9 : R3 / I10 : nc / I11 : MOSI / I12 : MISO / I13 : SCK | r-pi automation | justgeek.de | v0.1